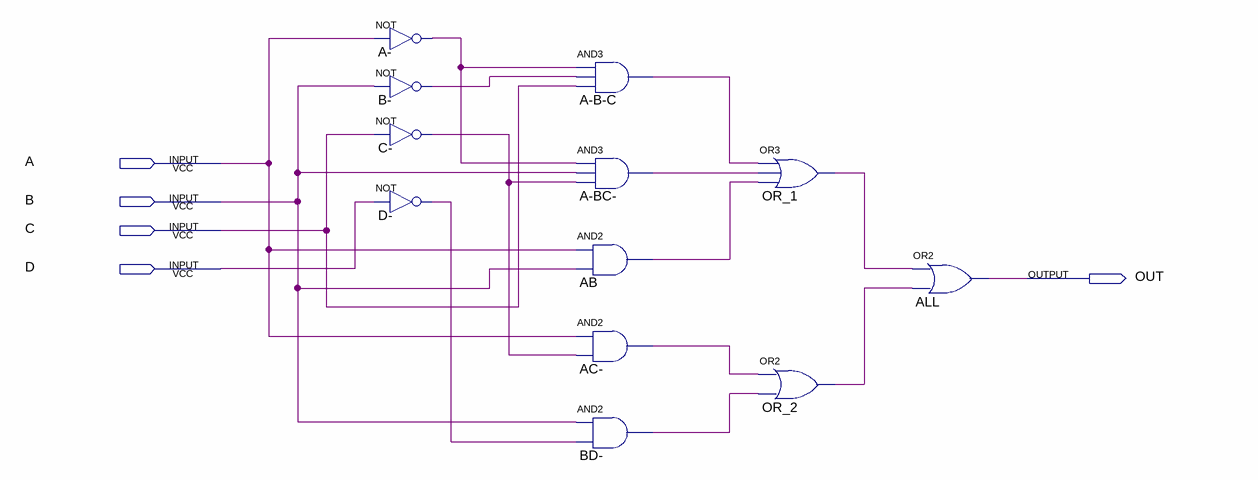
[diagram p0: schematic sheet]
// Quartus schematic g.bdf as structural Verilog: 12 symbols, 5 pins
module g (
  input  A,
  input  B,
  input  C,
  input  D,
  output OUT
);

  wire A__out, A_B_C_out, A_BC__out, AB_out, AC__out, B__out, BD__out, C__out, D__out, OR_1_out, OR_2_out;

  not \A-  (A__out, A);
  not \B-  (B__out, B);
  not \C-  (C__out, C);
  not \D-  (D__out, D);
  and \A-B-C  (A_B_C_out, A__out, B__out, C);
  and \A-BC-  (A_BC__out, A__out, B, C__out);
  and AB (AB_out, A, B);
  and \AC-  (AC__out, A, C__out);
  and \BD-  (BD__out, B, D__out);
  or OR_1 (OR_1_out, A_B_C_out, A_BC__out, AB_out);
  or OR_2 (OR_2_out, AC__out, BD__out);
  or ALL (OUT, OR_1_out, OR_2_out);
endmodule
